# EAGLE design Equipo04_EsquematicoLab05 (EAGLE 9.6.2)
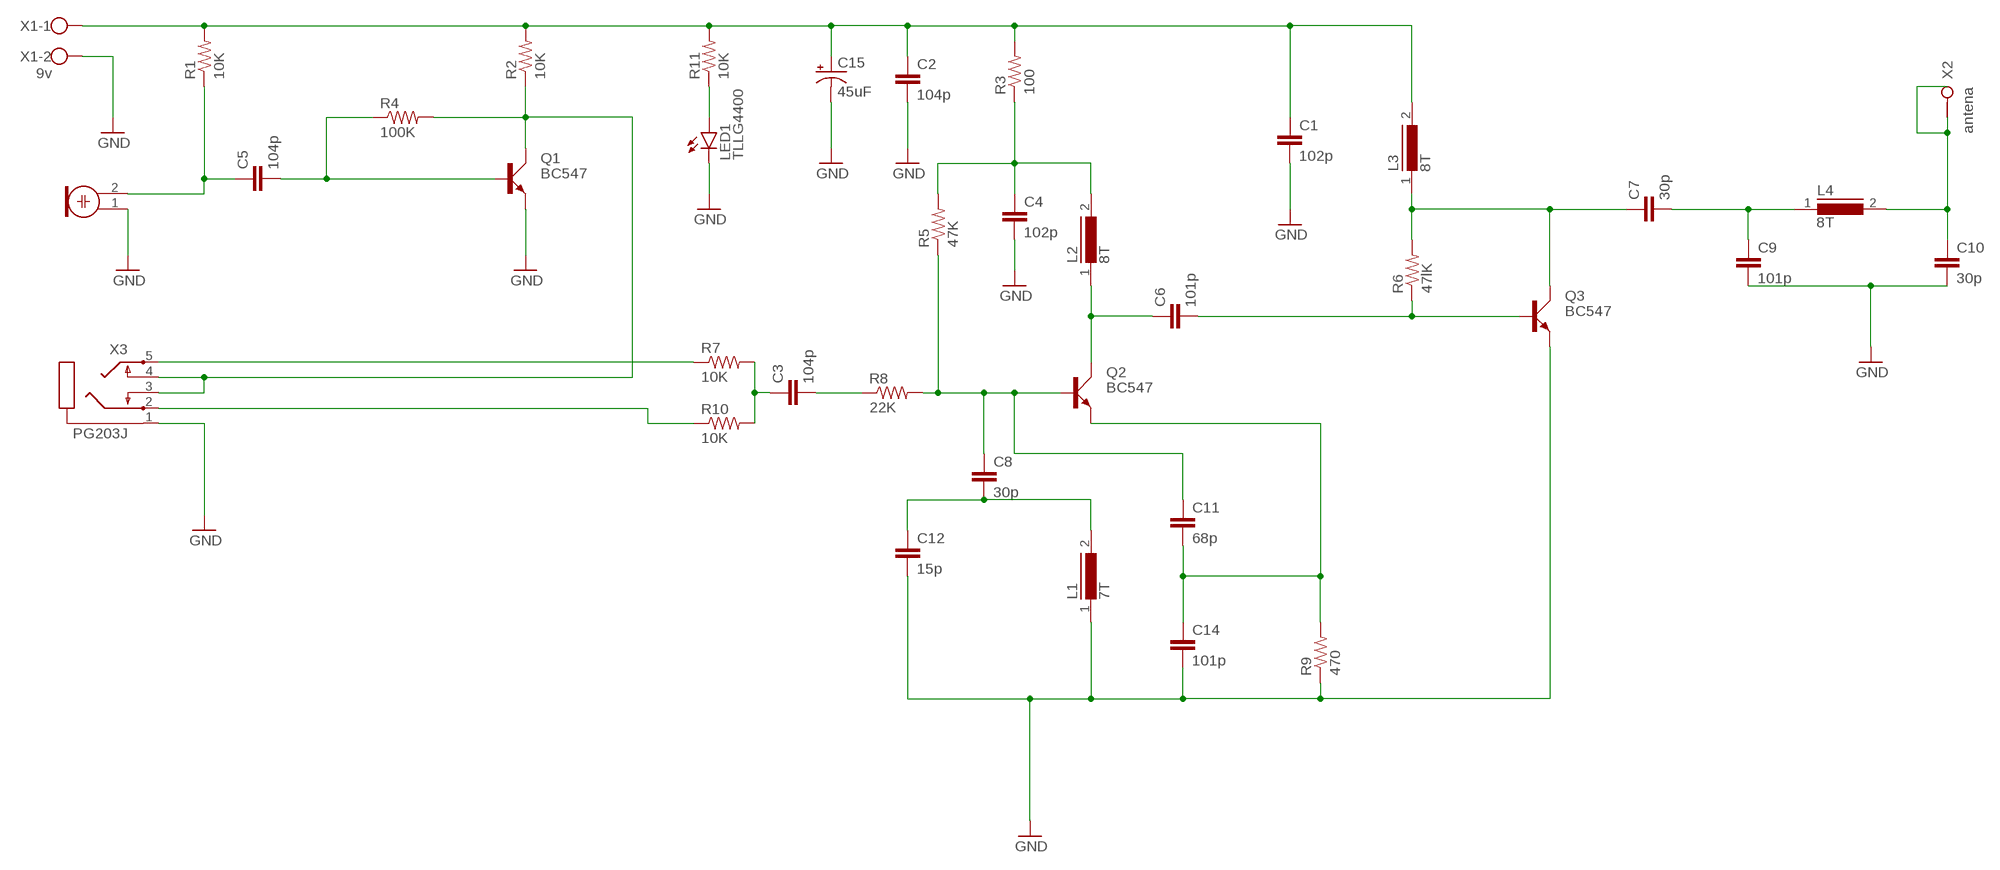
[diagram p0: schematic, sheet 1]

## Parts
C1  102p  C-EU050-024X044  [C050-024X044]
C2  104p  C-EU050-024X044  [C050-024X044]
C3  104p  C-EU050-024X044  [C050-024X044]
C4  102p  C-EU050-024X044  [C050-024X044]
C5  104p  C-EU050-024X044  [C050-024X044]
C6  101p  C-EU050-024X044  [C050-024X044]
C7  30p  C-EU050-024X044  [C050-024X044]
C8  30p  C-EU050-024X044  [C050-024X044]
C9  101p  C-EU050-024X044  [C050-024X044]
C10  30p  C-EU050-024X044  [C050-024X044]
C11  68p  C-EU050-024X044  [C050-024X044]
C12  15p  C-EU050-024X044  [C050-024X044]
C14  101p  C-EU050-024X044  [C050-024X044]
C15  45uF  CPOL-USE2-5  [E2-5]
L1  7T  A26GFC  [A26GFC]
L2  8T  A26GFC  [A26GFC]
L3  8T  A26GFC  [A26GFC]
L4  8T  A26GFC  [A26GFC]
LED1  TLLG4400  [LED3MM]
M1  ELECTRET_MICROPHON-WM-62PC/62PK  [WM-62PC/62PK]
Q1  BC547  [SOT54A]
Q2  BC547  [SOT54A]
Q3  BC547  [SOT54A]
R1  10K  R-US_0309/10  [0309/10]
R2  10K  R-US_0309/10  [0309/10]
R3  100  R-US_0309/10  [0309/10]
R4  100K  R-US_0309/10  [0309/10]
R5  47K  R-US_0309/10  [0309/10]
R6  47lK  R-US_0309/10  [0309/10]
R7  10K  R-US_0309/10  [0309/10]
R8  22K  R-US_0309/10  [0309/10]
R9  470  R-US_0309/10  [0309/10]
R10  10K  R-US_0309/10  [0309/10]
R11  10K  R-US_0309/10  [0309/10]
X1  9v  W237-102  [W237-102]
X2  antena  W236-1  [W236-1]
X3  PG203J  [PG203J]

## Nets
GND: C1.2 C2.2 C4.2 C9.2 C10.2 C12.2 C14.2 C15.- L1.1 LED1.K(C) M1.1 Q1.E Q3.E R9.1 X1.2 X3.1
N$1: C4.1 L2.2 R3.1 R5.2
N$2: C1.1 C2.1 C15.+ L3.2 R1.2 R2.2 R3.2 R11.2 X1.1
N$3: C5.1 M1.2 R1.1
N$4: C5.2 Q1.B R4.1
N$5: Q1.C R2.1 R4.2 X3.3 X3.4
N$6: LED1.A R11.1
N$7: R7.1 X3.5
N$8: R10.1 X3.2
N$9: C3.1 R7.2 R10.2
N$10: C3.2 R8.1
N$11: C6.1 L2.1 Q2.C
N$12: C8.1 C11.1 Q2.B R5.1 R8.2
N$13: C8.2 C12.1 L1.2
N$14: C7.2 C9.1 L4.1
N$15: C11.2 C14.1 Q2.E R9.2
N$16: C6.2 Q3.B R6.1
N$17: C7.1 L3.1 Q3.C R6.2
N$18: C10.1 L4.2 X2.1(KL1)
Unconnected: X2.2(KL2)

## Library data of the parts
C1-C12 C14 = rcl:C-EU: CAPACITOR, European symbol; SPICEPREFIX: C
C15 = rcl:CPOL-US: POLARIZED CAPACITOR, American symbol; SPICEPREFIX: C
L1-L4 = inductors:A26GFC: INDUCTOR; SPICEPREFIX: L
LED1 = led:TLLG4400: Low Current (2mA) LED 3 mm Tinted Diffused Package color GREEN Source: Data sheet <http://www.farnell.com/datasheets/391098.pdf>; MF: VISHAY SEMICONDUCTOR; OC_FARNELL: 1612435
M1 = microphon:ELECTRET_MICROPHON-: Electret Condenser Microphone
Q1-Q3 = transistor-small-signal:BC547: NPN TRANSISTOR
R1-R11 = rcl:R-US_: RESISTOR, American symbol; SPICEPREFIX: R
X1 = con-wago-500:W237-102: WAGO SCREW CLAMP; MPN: 237-102; OC_FARNELL: unknown; OC_NEWARK: 70K9898
X2 = con-wago-508:W236-1: WAGO SREW CLAMP; OC_FARNELL: unknown; OC_NEWARK: unknown
X3 = con-hirschmann:PG203J: MIC/HEADPHONE JACK KS-S stereo microphone/headphone jack PG203JN (Schukat); OC_FARNELL: unknown; OC_NEWARK: unknown

## Board
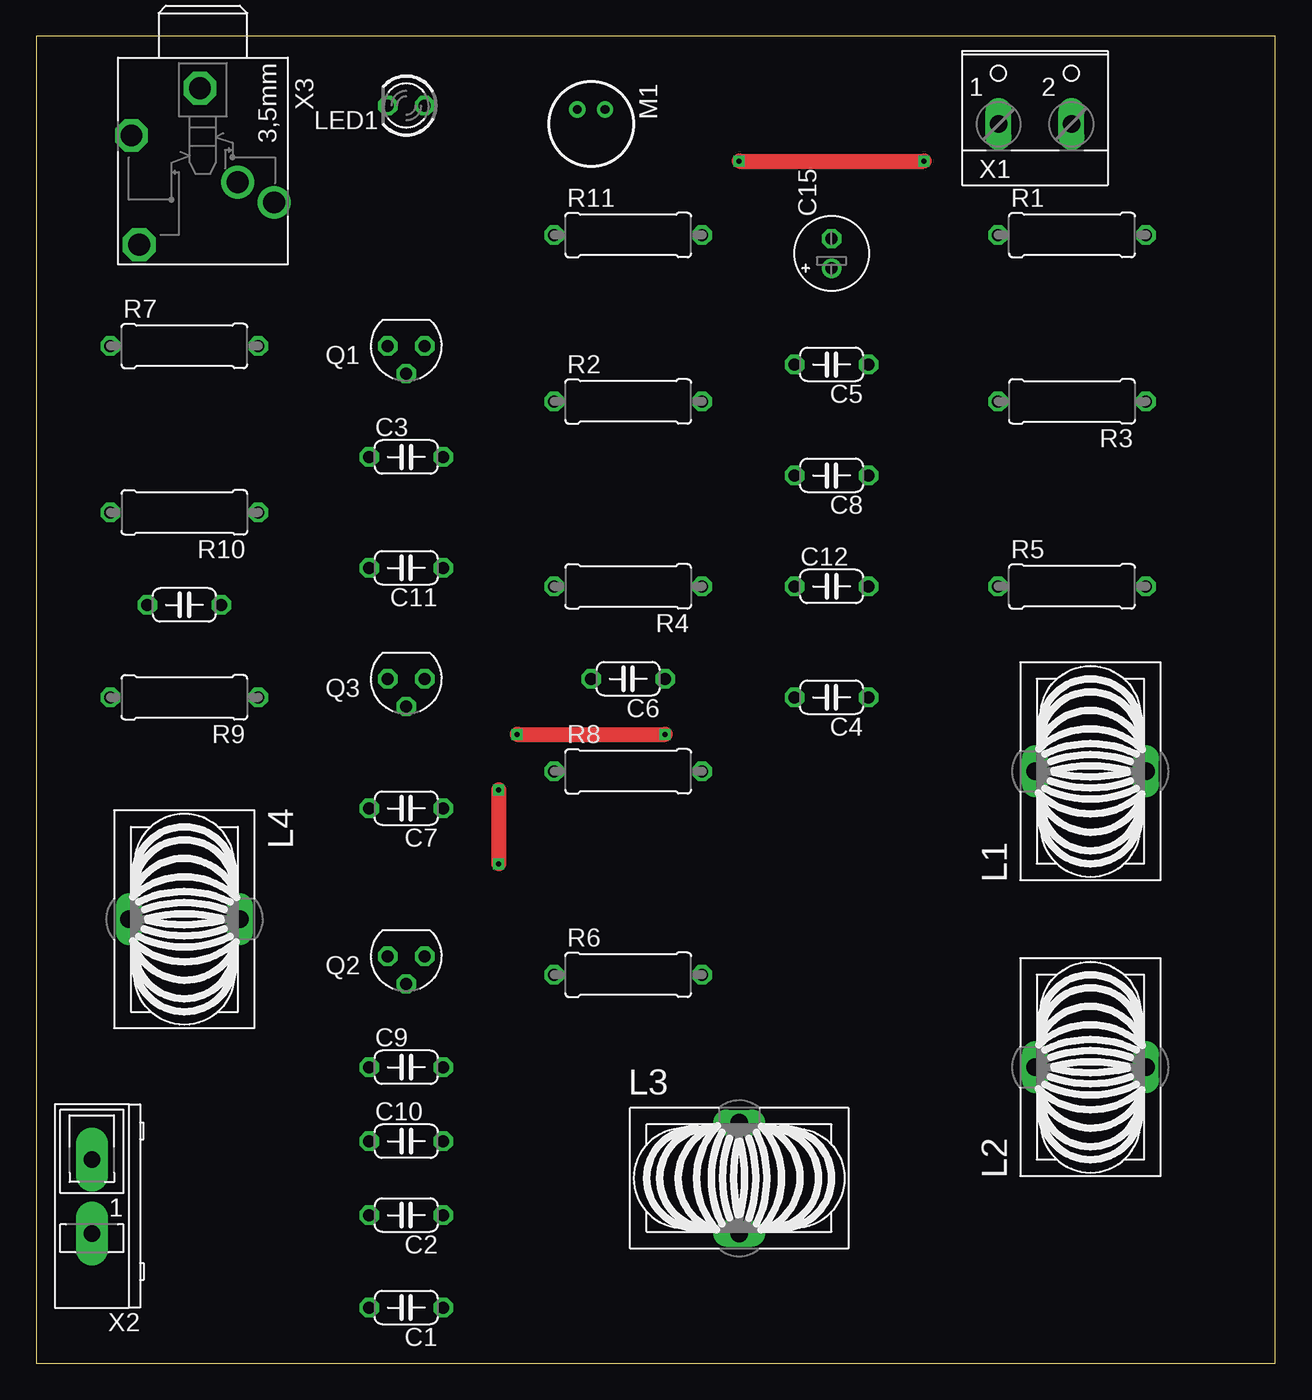
[diagram p1: board, top side]
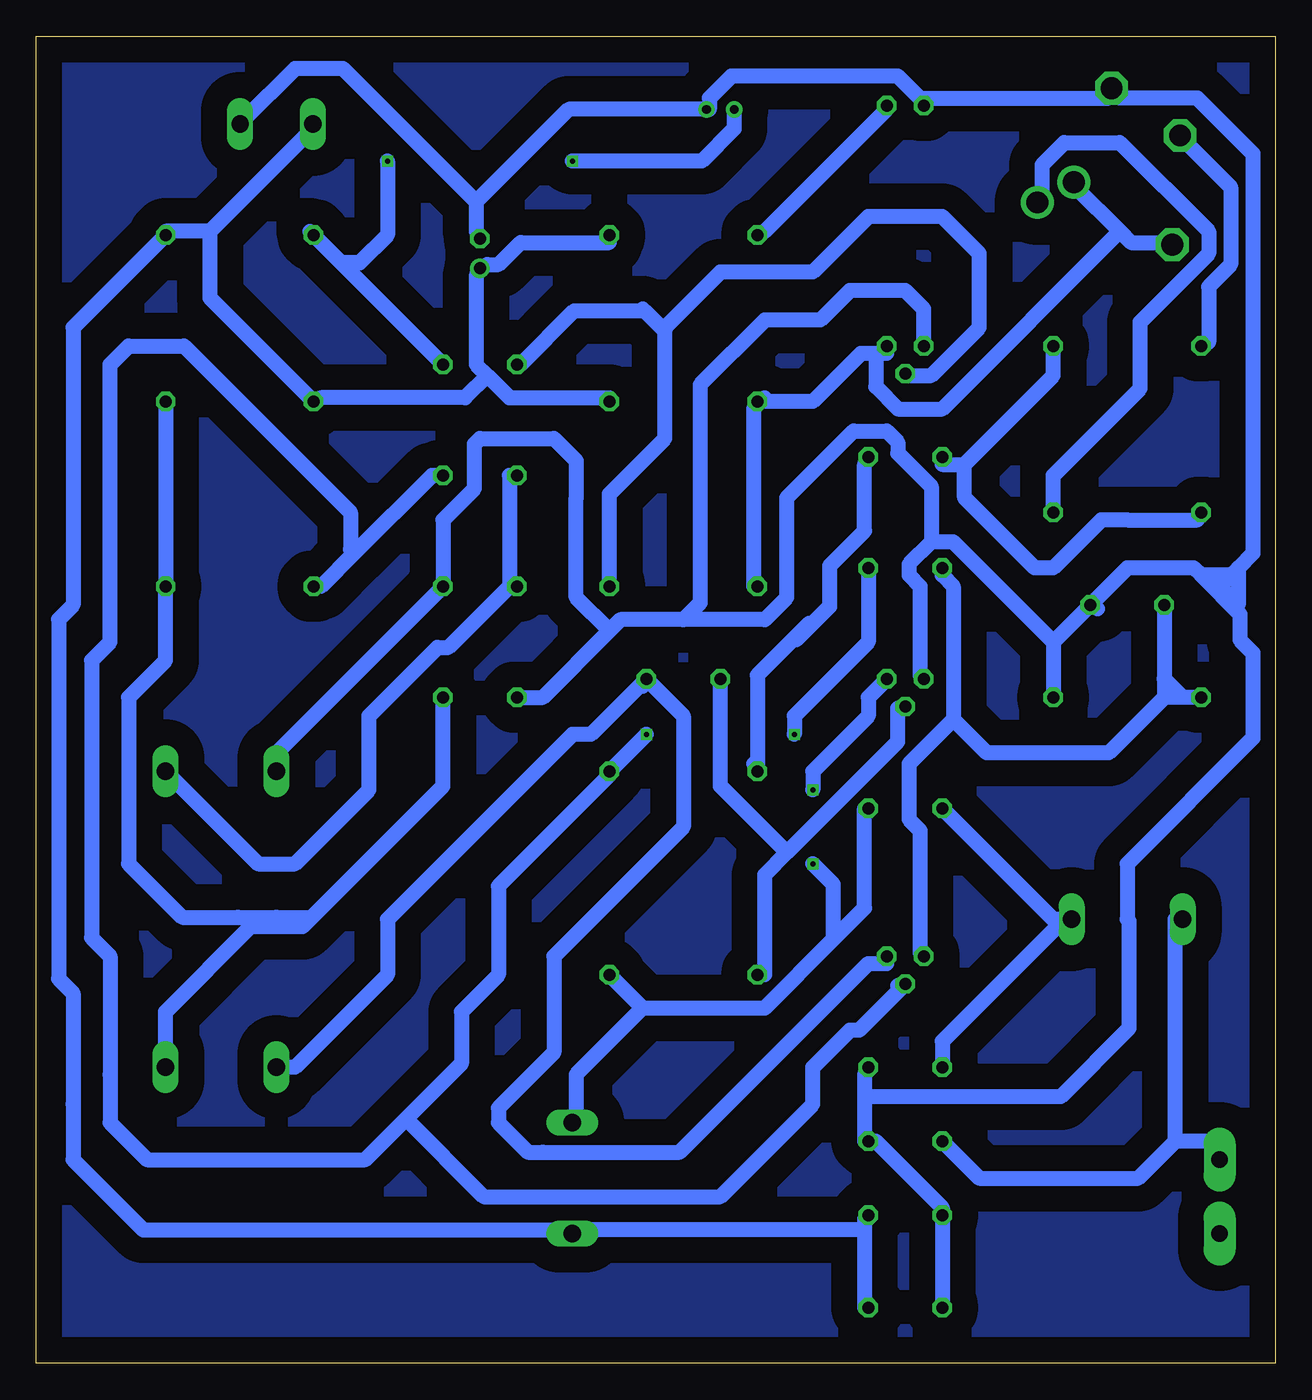
[diagram p2: board, bottom side, seen from below]

Size 85.07 x 91.11 mm. Coordinates in mm from the lower left corner, seen from the top.
Outline: 0,0 85.07,0 85.07,91.11 0,91.11 0,0
Copper layers (1*16): Top 0.035mm / dielectric 1.5mm / Bottom 0.035mm
Design rules "default *": minimum track width 40mil, minimum drill 0.35mm, track to track 20mil, track to pad 20mil, pad to pad 20mil, via to via 20mil, smd to smd 6mil, copper to edge 40mil, drill to drill 6mil, minimum pad ring 10mil, minimum via ring 8mil, stop-mask expansion 4mil, vias tented up to drill 0mil, thermal gap 10mil

### Footprints (pad centres in the part's own frame; a part is rotated, then mirrored left to right if it is on the bottom)
C050-024X044 = drill 0.813 octagon: 1 -2.54,0; 2 2.54,0
E2-5 = drill 0.813 pad 1.27: + -1.016,0 | drill 0.813 pad 1.27 octagon: - 1.016,0
A26GFC = drill 1.194 long: 1 0,3.81; 2 0,-3.81
LED3MM = drill 0.813 octagon: A -1.27,0; K 1.27,0
WM-62PC/62PK = drill 0.6 pad 1: 1 -1,0.95; 2 -1,-0.95
SOT54A = drill 0.813 octagon: B 0,1.905; C -1.27,0; E 1.27,0
0309/10 = drill 0.813 octagon: 1 -5.08,0; 2 5.08,0
W237-102 = drill 1.194 long: 1 -2.5,-1.27; 2 2.5,-1.27
W236-1 = drill 1.118 pad 2.184 long: 1 0,-2.54; 2 0,2.54
PG203J = drill 1.499 octagon: 1 -5.004,-0.203; 4 5.74,-4.369; 5 -1.753,-4.902 | drill 1.499: 2 2.845,4.902; 3 1.448,2.388

### Placement (x,y rotation side)
C1  25.4,3.81 180 top
C2  25.4,10.16 180 top
C3  25.4,62.23 0 top
C4  54.61,45.72 180 top
C5  54.61,68.58 180 top
C6  40.64,46.99 180 top
C7  25.4,38.1 180 top
C8  54.61,60.96 180 top
C9  25.4,20.32 0 top
C10  25.4,15.24 0 top
C11  25.4,54.61 180 top
C12  54.61,53.34 0 top
C14  10.16,52.07 0 top
C15  54.61,76.2 90 top
L1  72.39,40.64 90 top
L2  72.39,20.32 90 top
L3  48.26,12.7 0 top
L4  10.16,30.48 270 top
LED1  25.4,86.36 180 top
M1  38.1,85.09 270 top
Q1  25.4,69.85 180 top
Q2  25.4,27.94 180 top
Q3  25.4,46.99 180 top
R1  71.12,77.47 0 top
R2  40.64,66.04 0 top
R3  71.12,66.04 180 top
R4  40.64,53.34 180 top
R5  71.12,53.34 0 top
R6  40.64,26.67 0 top
R7  10.16,69.85 0 top
R8  40.64,40.64 0 top
R9  10.16,45.72 180 top
R10  10.16,58.42 180 top
R11  40.64,77.47 0 top
X1  68.58,86.36 0 top
X2  3.81,11.43 180 top
X3  11.43,82.55 270 top

### Tracks (layer width: path | path; a pad name or v marks a point on that pad's centre or on a via)
GND
  Bottom 1.016: 38.86,86.11 38.86,86.87 37.34,88.39 25.91,88.39 24.38,86.87 | 38.86,86.11 M1.1 | X1.2 70.87,85.34 67.31,88.9 64.01,88.9 54.86,79.76 | C15.- 54.86,77.72 54.86,79.76 | 24.38,86.87 11.43,86.87 X3.1 10.67,86.87 5.33,86.87 1.52,83.06 1.52,55.63 2.54,54.61 | 24.38,86.87 LED1.K | L1.1 68.58,41.91 C12.2 57.15,57.91 54.99,60.07 54.99,63.12 54.61,63.5 49.53,63.5 48.01,61.98 48.01,59.44 48.01,52.58 45.72,50.29 | 28.19,18.29 28.19,19.81 C9.2 | 28.19,18.29 28.19,15.24 C10.2 27.43,15.24 22.86,10.67 C2.2 C1.2 | 15.24,49.53 R9.1 | C14.2 15.24,49.53 | 23.62,56.39 25.15,54.86 25.15,54.1 24.38,53.34 24.38,47.24 Q3.E | 23.62,56.39 22.1,56.39 15.24,49.53 | 45.72,50.29 50.29,45.72 C4.2 | 23.62,56.39 23.62,60.2 25.91,62.48 25.91,63.25 26.67,64.01 28.96,64.01 33.53,59.44 33.53,52.58 35.05,51.05 40.64,51.05 | 12.19,51.82 C14.2 | 38.86,86.11 48.51,86.11 54.86,79.76 | 40.64,51.05 39.5,52.2 39.5,67.18 35.05,71.63 31.24,71.63 29.21,73.66 25.4,73.66 24.13,72.39 Q1.E | 40.64,51.05 44.96,51.05 45.72,50.29 | 28.19,18.29 14.73,18.29 10.03,22.99 10.03,30.35 10.16,30.48 10.16,34.29 1.52,42.93 1.52,48.77 2.41,49.66 2.41,51.44 5.08,54.1 | 3.05,54.1 3.81,54.1 | 3.81,54.1 5.08,54.1 | 3.05,54.1 2.54,54.61 | 2.54,54.61 2.54,52.07 3.81,53.34 | 3.81,53.34 3.81,54.1 | 3.05,54.1 3.81,53.34 | 5.08,54.1 5.59,54.61 10.16,54.61 C14.2
N$1
  Bottom 1.016: R3.1 R5.2 76.2,48.26 78.74,45.72 78.74,34.29 75.06,30.61 71.25,30.61 68.58,30.61 66.17,30.61 | C4.1 57.15,39.62 66.17,30.61 | 66.17,30.61 66.8,29.97 70.36,29.97 76.2,24.13 L2.2 76.2,20.57
N$2
  Bottom 1.016: 28.19,9.14 28.19,9.91 C2.1 | 28.19,9.14 28.19,3.81 C1.1 | 28.19,9.14 48.01,9.14 L3.2 48.77,9.14 72.39,9.14 73.91,9.14 77.72,9.14 82.55,13.97 82.55,17.78 82.55,25.4 83.55,26.4 83.55,51.07 82.55,52.07 82.55,71.12 R1.2 76.2,77.72 73.15,77.72 | 73.15,77.72 66.29,84.58 X1.1 | 54.1,67.82 54.86,68.58 54.86,74.68 C15.+ 54.1,75.44 53.34,75.44 51.82,76.96 45.72,76.96 R11.2 | 54.1,67.82 52.58,66.29 45.72,66.29 R2.2 | 54.1,67.82 55.63,66.29 65.53,66.29 R3.2 73.15,73.15 73.15,77.72
N$3  (via drill 0.35)
  Top 1.016: v48.26,82.55 v60.96,82.55
  Bottom 1.016: 64.14,75.56 R1.1 66.29,77.72 | 64.14,75.56 C5.1 | M1.2 37.15,84.77 39.37,82.55 v48.26,82.55 | v60.96,82.55 60.96,77.47 62.87,75.56 64.14,75.56
N$4
  Bottom 1.016: Q1.B 25.15,67.82 23.62,67.82 20.32,71.12 20.32,72.39 20.32,76.2 22.86,78.74 27.94,78.74 31.75,74.93 34.29,74.93 38.1,74.93 41.91,71.12 41.91,70.87 | C5.2 51.82,68.58 48.13,72.26 43.31,72.26 | R4.1 45.72,59.69 41.91,63.5 41.91,70.87 | 43.31,72.26 43.43,72.39 | 43.31,72.26 41.91,70.87
N$5
  Bottom 1.016: 10.67,77.72 13.72,80.77 X3.3 | 10.67,77.72 9.91,76.96 7.62,76.96 X3.4 | R4.2 35.81,53.34 35.81,65.53 R2.1 | 27.43,69.34 26.67,69.34 Q1.C | 35.05,66.29 R2.1 | 10.67,77.72 22.86,65.53 25.91,65.53 27.43,67.06 27.43,69.34 | 27.43,69.34 28.45,69.34 31.75,66.04 R2.1
N$6
  Bottom 1.016: LED1.A 26.67,86.11 35.05,77.72 R11.1
N$7
  Bottom 1.016: R7.1 4.57,70.1 4.57,73.91 3.05,75.44 3.05,80.77 6.1,83.82 X3.5
N$8
  Bottom 1.016: X3.2 16,80.01 16,82.3 14.48,83.82 10.67,83.82 4.57,77.72 4.57,76.2 9.27,71.5 9.27,66.93 15.24,60.96 R10.1
N$9
  Bottom 1.016: 21.34,61.72 22.86,61.72 C3.1 | R10.2 5.33,57.91 10.16,57.91 11.94,57.91 15.24,54.61 16.51,54.61 21.34,59.44 21.34,61.72 | R7.2 15.24,67.82 21.34,61.72
N$10
  Bottom 1.016: C3.2 28.19,61.72 28.19,57.15 30.61,54.74 30.61,51.94 32.89,49.66 33.15,49.66 | 35.81,41.15 R8.1 35.56,47.24 33.15,49.66 | 32,50.8 33.15,49.66
N$11
  Bottom 1.016: Q2.C 26.67,27.43 27.94,27.43 40.89,14.48 50.29,14.48 51.31,14.48 53.34,16.51 53.34,17.53 51.82,19.05 49.53,21.34 49.53,27.94 40.64,36.83 40.64,44.45 C6.1 | 43.43,46.48 C6.1 | 68.58,20.57 L2.1 67.31,20.32 60.96,26.67 60.96,30.48 48.26,43.18 46.99,43.18 C6.1
N$12  (via drill 0.35)
  Top 1.016: v33.02,43.18 v43.18,43.18
  Bottom 1.016: 63.25,55.63 57.91,60.96 C8.1 | 63.25,55.63 65.53,53.34 R5.1 | 25.91,25.91 Q2.B 28.57,22.86 29.21,22.86 31.75,20.32 31.75,17.78 38.1,11.43 54.36,11.43 59.69,16.76 | 63.25,55.63 63.5,55.88 63.5,58.42 74.93,69.85 78.74,69.85 80.01,68.58 80.01,49.53 81.28,48.26 81.28,29.21 80.01,27.94 80.01,19.81 80.01,16.51 77.47,13.97 62.48,13.97 59.69,16.76 | 59.69,16.76 55.88,20.57 55.88,24.13 53.34,26.67 53.34,32.77 45.72,40.39 R8.2 v43.18,43.18 | C11.1 27.94,49.53 33.02,44.45 v33.02,43.18
N$13
  Bottom 1.016: 52.58,53.34 52.58,60.96 C8.2 | 52.58,53.34 56.77,49.15 57.53,49.15 62.23,44.45 62.23,39.37 67.31,34.29 69.85,34.29 L1.2 76.2,40.39 | 52.58,53.34 C12.1
N$14
  Bottom 1.016: C9.1 22.86,22.1 14.48,30.48 | C7.2 15.24,30.48 14.48,30.48 | 14.48,30.48 L4.1
N$15
  Bottom 1.016: 7.62,51.82 C14.1 7.62,46.99 | 22.1,44.2 25.15,41.15 25.15,37.34 24.38,36.58 24.38,28.19 Q2.E | 22.1,44.2 22.1,53.34 22.86,54.1 C11.2 | 5.33,45.72 R9.2 6.35,45.72 | 6.35,45.72 7.62,45.72 | 22.1,44.2 19.81,41.91 11.43,41.91 7.62,45.72 | 7.62,46.99 7.62,45.72 | 6.35,45.72 7.62,46.99
N$16
  Bottom 1.016: 33.53,35.05 35.05,33.53 35.05,26.67 R6.1 | 33.53,35.05 25.91,42.67 25.91,44.96 Q3.B | C6.2 38.1,39.62 33.53,35.05
N$17  (via drill 0.35)
  Top 1.016: v31.75,39.37 v31.75,34.29
  Bottom 1.016: 30.35,29.08 35.05,24.38 43.43,24.38 | 30.35,29.08 28.19,31.24 28.19,38.1 C7.1 | R6.2 43.43,24.38 | 43.43,24.38 48.01,19.81 48.01,16.76 L3.1 | Q3.C 27.94,45.72 27.94,44.45 31.75,40.64 v31.75,39.37 | v31.75,34.29 30.35,32.89 30.35,29.08
N$18
  Bottom 1.016: 6.86,15.24 4.57,15.24 3.81,14.48 X2.1 | 6.86,15.24 6.86,30.48 L4.2 | C10.1 20.32,12.7 9.4,12.7 6.86,15.24
N$19
  pour Bottom (isolate 1.778): 0,0 85.09,0 85.09,91.44 0,91.44